# Altium project Main Board.PrjPcb
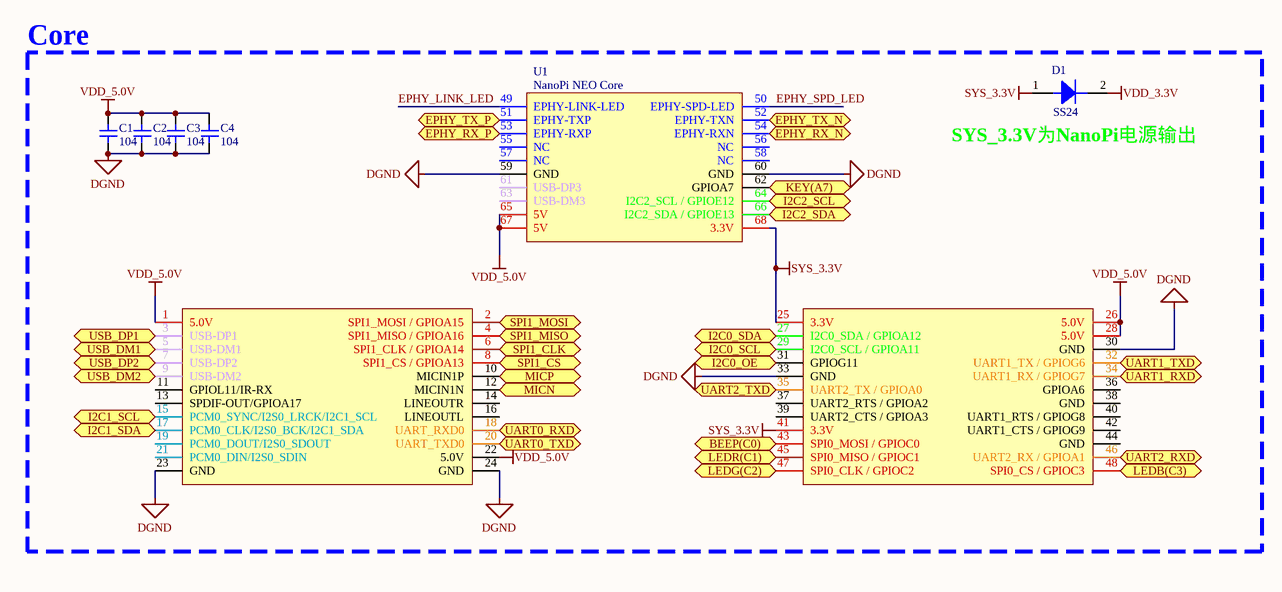
[diagram p0: core.SchDoc]
2 sheets, 38 parts. Net scope: flat (ports and power ports of the same name join across sheets).
Board file: main_board.PcbDoc
Sheets:
  core.SchDoc
  power.SchDoc

## Sheet core.SchDoc
size A4

### Parts
C1  104  [0805C]
C2  104  [0805C]
C3  104  [0805C]
C4  104  [0805C]
D1  SS24  [SMA/DO-214AC]
U1  NanoPi NEO Core  [NanoPi NEO Core]

### Ports
BEEP(C0), EPHY_RX_N, EPHY_RX_P, EPHY_TX_N, EPHY_TX_P, I2C0_OE, I2C0_SCL, I2C0_SDA, I2C1_SCL, I2C1_SDA, I2C2_SCL, I2C2_SDA, KEY(A7), LEDB(C3), LEDG(C2), LEDR(C1), MICN, MICP, SPI1_CLK, SPI1_CS, SPI1_MISO, SPI1_MOSI, UART0_RXD, UART0_TXD, UART1_RXD, UART1_TXD, UART2_RXD, UART2_TXD, USB_DM1, USB_DM2, USB_DP1, USB_DP2

### Nets
DGND: C1.1 C2.1 C3.1 C4.1 U1.23(GND) U1.24(GND) U1.30(GND) U1.33(GND) U1.59(GND) U1.60(GND)
SYS_3.3V: D1.1 U1.25(3.3V) U1.41(3.3V) U1.68(3.3V)
VDD_3.3V: D1.2
VDD_5.0V: C1.2 C2.2 C3.2 C4.2 U1.1(5.0V) U1.22(5.0V) U1.26(5.0V) U1.28(5.0V) U1.65(5V) U1.67(5V)
BEEP(C0): U1.43(SPI0_MOSI_/_GPIOC0) ; port BEEP(C0)
EPHY_LINK_LED: U1.49(EPHY-LINK-LED)
EPHY_RX_N: U1.54(EPHY-RXN) ; port EPHY_RX_N
EPHY_RX_P: U1.53(EPHY-RXP) ; port EPHY_RX_P
EPHY_SPD_LED: U1.50(EPHY-SPD-LED)
EPHY_TX_N: U1.52(EPHY-TXN) ; port EPHY_TX_N
EPHY_TX_P: U1.51(EPHY-TXP) ; port EPHY_TX_P
I2C0_OE: U1.31(GPIOG11) ; port I2C0_OE
I2C0_SCL: U1.29(I2C0_SCL_/_GPIOA11) ; port I2C0_SCL
I2C0_SDA: U1.27(I2C0_SDA_/_GPIOA12) ; port I2C0_SDA
I2C1_SCL: U1.15(PCM0_SYNC/I2S0_LRCK/I2C1_SCL) ; port I2C1_SCL
I2C1_SDA: U1.17(PCM0_CLK/I2S0_BCK/I2C1_SDA) ; port I2C1_SDA
I2C2_SCL: U1.64(I2C2_SCL_/_GPIOE12) ; port I2C2_SCL
I2C2_SDA: U1.66(I2C2_SDA_/_GPIOE13) ; port I2C2_SDA
KEY(A7): U1.62(GPIOA7) ; port KEY(A7)
LEDB(C3): U1.48(SPI0_CS_/_GPIOC3) ; port LEDB(C3)
LEDG(C2): U1.47(SPI0_CLK_/_GPIOC2) ; port LEDG(C2)
LEDR(C1): U1.45(SPI0_MISO_/_GPIOC1) ; port LEDR(C1)
MICN: U1.12(MICIN1N) ; port MICN
MICP: U1.10(MICIN1P) ; port MICP
SPI1_CLK: U1.6(SPI1_CLK_/_GPIOA14) ; port SPI1_CLK
SPI1_CS: U1.8(SPI1_CS_/_GPIOA13) ; port SPI1_CS
SPI1_MISO: U1.4(SPI1_MISO_/_GPIOA16) ; port SPI1_MISO
SPI1_MOSI: U1.2(SPI1_MOSI_/_GPIOA15) ; port SPI1_MOSI
UART0_RXD: U1.18(UART_RXD0) ; port UART0_RXD
UART0_TXD: U1.20(UART_TXD0) ; port UART0_TXD
UART1_RXD: U1.34(UART1_RX_/_GPIOG7) ; port UART1_RXD
UART1_TXD: U1.32(UART1_TX_/_GPIOG6) ; port UART1_TXD
UART2_RXD: U1.46(UART2_RX_/_GPIOA1) ; port UART2_RXD
UART2_TXD: U1.35(UART2_TX_/_GPIOA0) ; port UART2_TXD
USB_DM1: U1.5(USB-DM1) ; port USB_DM1
USB_DM2: U1.9(USB-DM2) ; port USB_DM2
USB_DP1: U1.3(USB-DP1) ; port USB_DP1
USB_DP2: U1.7(USB-DP2) ; port USB_DP2

Not connected (* = marked no-connect by the designer): U1 11(GPIOL11/IR-RX) 13(SPDIF-OUT/GPIOA17) 14(LINEOUTR) 16(LINEOUTL) 19(PCM0_DOUT/I2S0_SDOUT) 21(PCM0_DIN/I2S0_SDIN) 36(GPIOA6) 37(UART2_RTS_/_GPIOA2) 38(GND) 39(UART2_CTS_/_GPIOA3) 40(UART1_RTS_/_GPIOG8) 42(UART1_CTS_/_GPIOG9) 44(GND) 55(NC) 56(NC) 57(NC) 58(NC) 61(USB-DP3) 63(USB-DM3)

### Notes on the sheet
- Core
- (near U1) SYS_3.3V为NanoPi电源输出

### Library data of the parts
C1-C4 = Cap1: 无极贴片电容
D1 = Diode: 二极管

## Sheet power.SchDoc
size A3
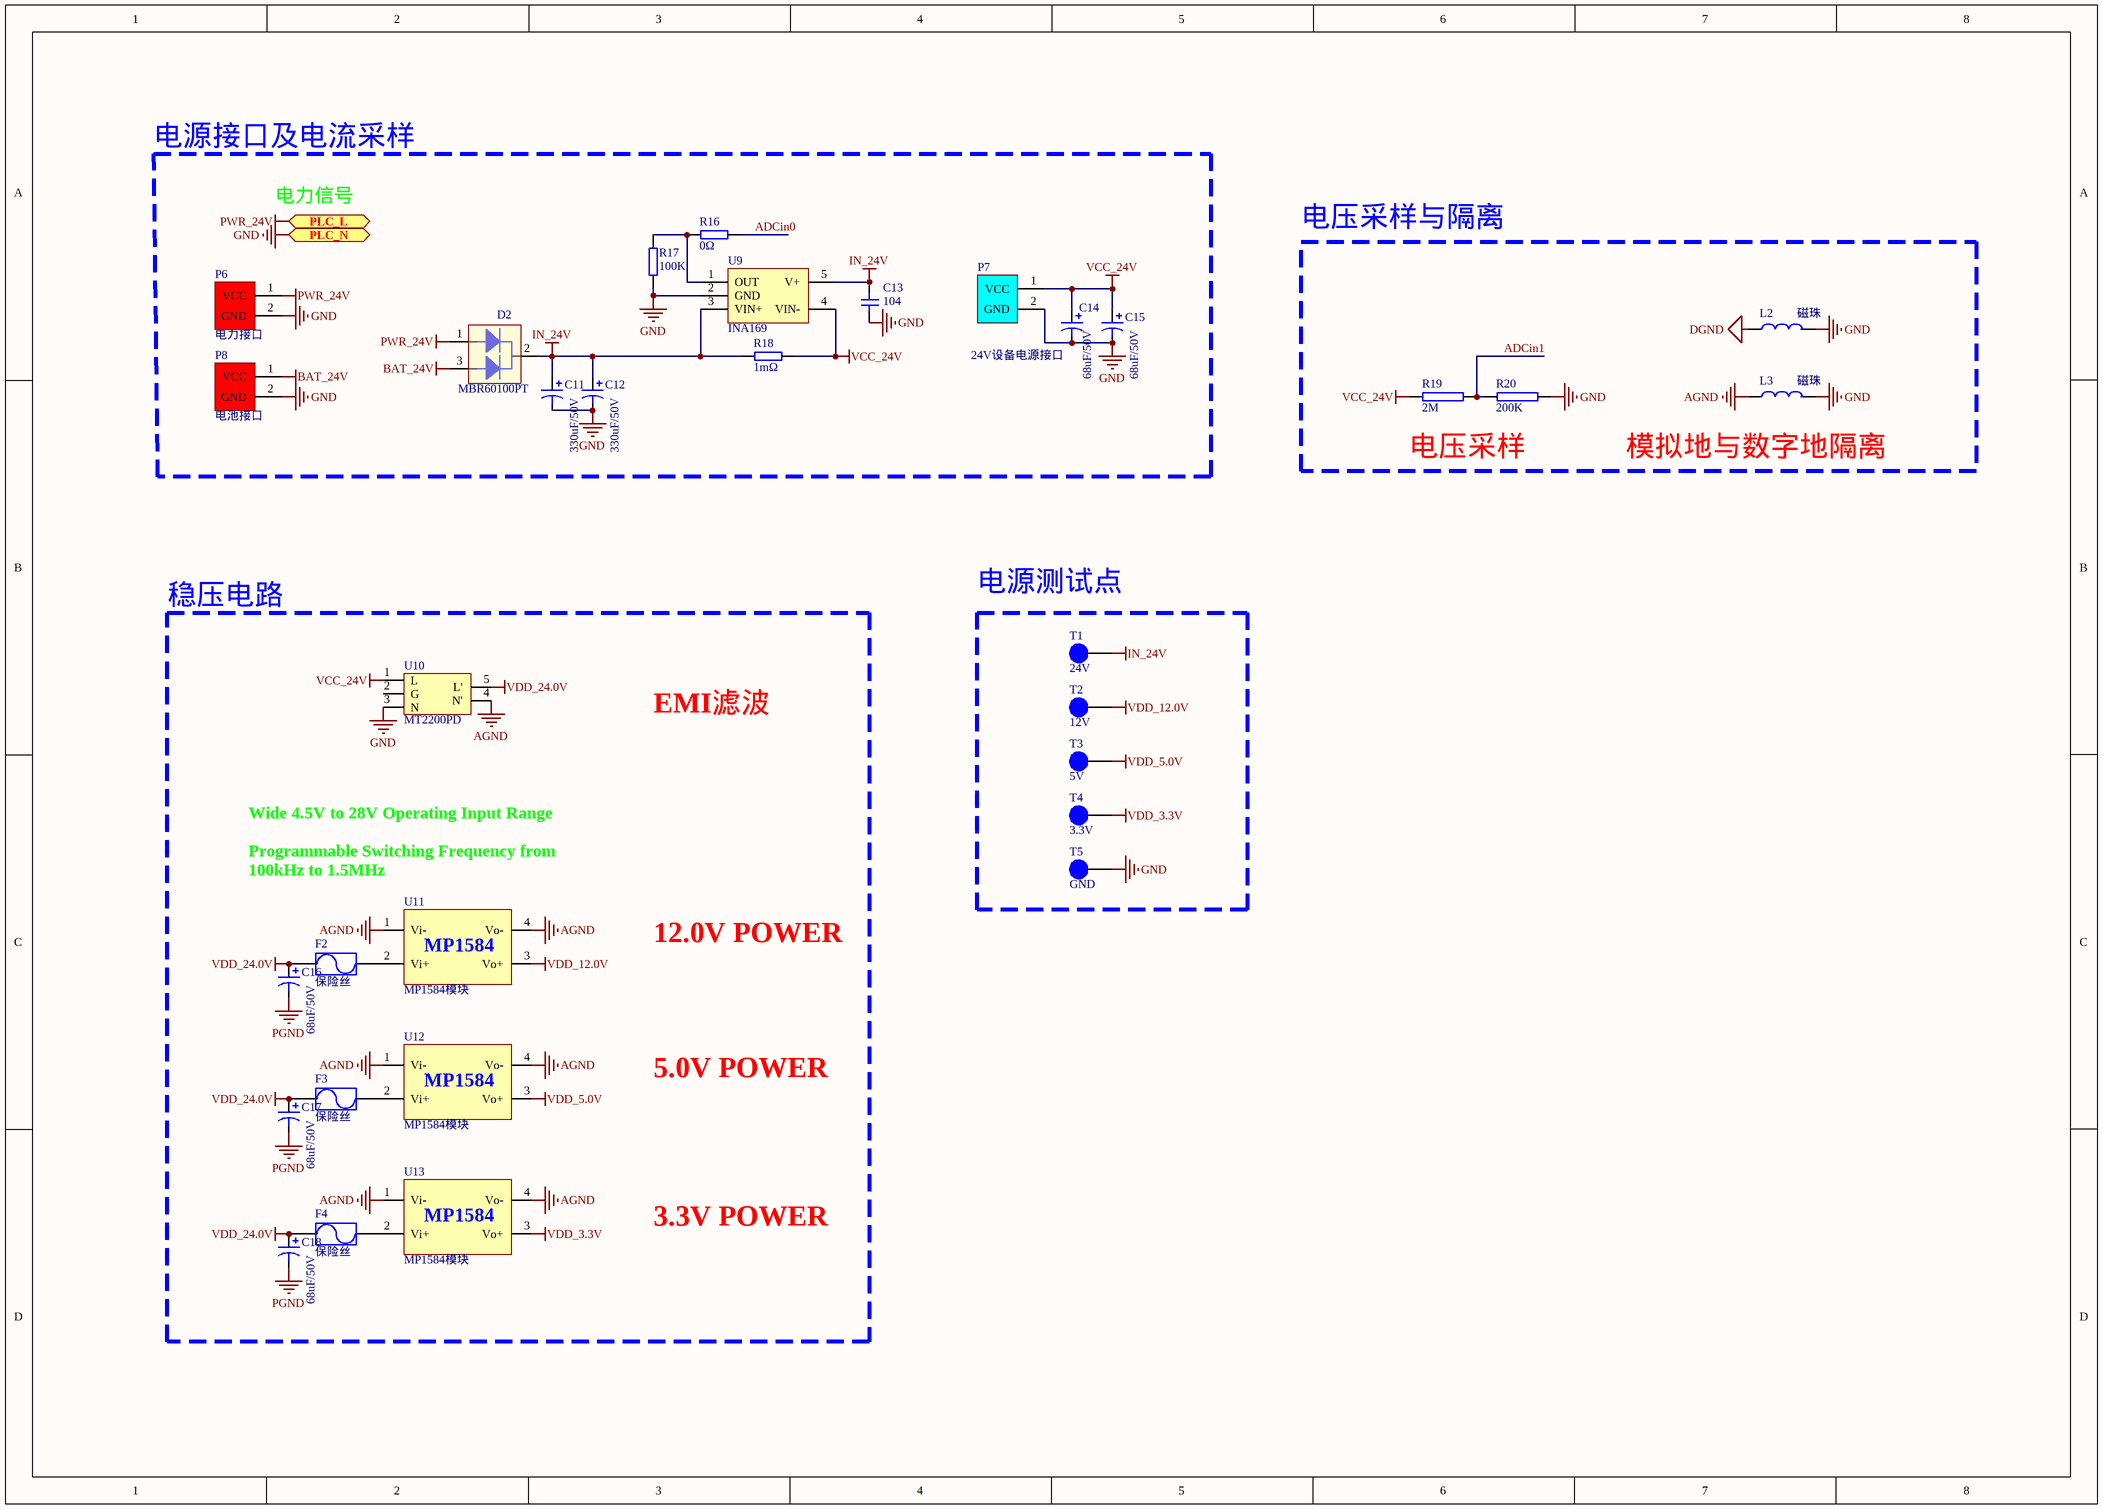
[diagram p1: power.SchDoc]

### Parts
C11  330uF/50V  [RB.2.4]
C12  330uF/50V  [RB.2.4]
C13  104  [0805C]
C14  68uF/50V  [RB.1.2]
C15  68uF/50V  [RB.1.2]
C16  68uF/50V  [RB.1.2]
C17  68uF/50V  [RB.1.2]
C18  68uF/50V  [RB.1.2]
D2  MBR60100PT  [TO-247LS]
F2  保险丝  [FUSE-1812]
F3  保险丝  [FUSE-1812]
F4  保险丝  [FUSE-1812]
L2  磁珠  [1206L]
L3  磁珠  [1206L]
P6  电力接口  [XT60-F]
P7  24V设备电源接口  [XT60-F]
P8  电池接口  [XT60-F]
R16  0Ω  [0805R]
R17  100K  [0805R]
R18  1mΩ  [2512R]
R19  2M  [0805R]
R20  200K  [0805R]
T1  24V  [HEADER 1]
T2  12V  [HEADER 1]
T3  5V  [HEADER 1]
T4  3.3V  [HEADER 1]
T5  GND  [HEADER 1]
U9  INA169  [SOT23-5]
U10  MT2200PD  [MT2200PD-6A]
U11  MP1584模块  [MP1584电源模块]
U12  MP1584模块  [MP1584电源模块]
U13  MP1584模块  [MP1584电源模块]

### Blocks framed on the sheet
电源接口及电流采样: C11-C15 D2 P6-P8 R16-R18 U9
电源测试点: T1-T5

### Ports
PLC_L, PLC_N

### Nets
AGND: L3.1 U10.4(N') U11.1(Vi-) U11.4(Vo-) U12.1(Vi-) U12.4(Vo-) U13.1(Vi-) U13.4(Vo-)
BAT_24V: D2.3 P8.1(VCC)
DGND: L2.1
GND: C11.2 C12.2 C13.1 C14.2 C15.2 L2.2 L3.2 P6.2(GND) P7.2(GND) P8.2(GND) R17.1 R20.2 T5.1 U9.2(GND) U10.3(N) ; port PLC_N
IN_24V: C11.1 C12.1 C13.2 D2.2 R18.2 T1.1 U9.3(VIN+) U9.5(V+)
PGND: C16.2 C17.2 C18.2
PWR_24V: D2.1 P6.1(VCC) ; port PLC_L
VCC_24V: C14.1 C15.1 P7.1(VCC) R18.1 R19.1 U9.4(VIN-) U10.1(L)
VDD_3.3V: T4.1 U13.3(Vo+)
VDD_5.0V: T3.1 U12.3(Vo+)
VDD_12.0V: T2.1 U11.3(Vo+)
VDD_24.0V: C16.1 C17.1 C18.1 F2.1 F3.1 F4.1 U10.5(L')
ADCin0: R16.1
ADCin1: R19.2 R20.1
NetF2_2: F2.2 U11.2(Vi+)
NetF3_2: F3.2 U12.2(Vi+)
NetF4_2: F4.2 U13.2(Vi+)
NetR16_2: R16.2 R17.2 U9.1(OUT)

Not connected (* = marked no-connect by the designer): U10 2(G)

### Notes on the sheet
- 电力信号
- 电压采样与隔离
- 电压采样
- (near L3) 模拟地与数字地隔离
- 稳压电路
- EMI滤波
- (near U11) Wide 4.5V to 28V Operating Input Range
  Programmable Switching Frequency from
  100kHz to 1.5MHz
- 12.0V POWER
- 5.0V POWER
- 3.3V POWER
- (in symbol MP1584电源模块) MP1584

### Library data of the parts
C11 C12 C14-C18 = Cap3: 直插极性电容
C13 = Cap1: 无极贴片电容
F2-F4 = Fuse
L2 L3 = L: 电感
P6 P8 = 电源端子
P7 = 推进器电源
R16-R18 = Res: 电阻
R19 R20 = R1
T1-T5 = 测试点
U11-U13 = MP1584电源模块

## Nets that join several sheets
DGND: core (10 pins), power (L2.1)
VDD_3.3V: core (D1.2), power (T4.1 U13.3)
VDD_5.0V: core (10 pins), power (T3.1 U12.3)